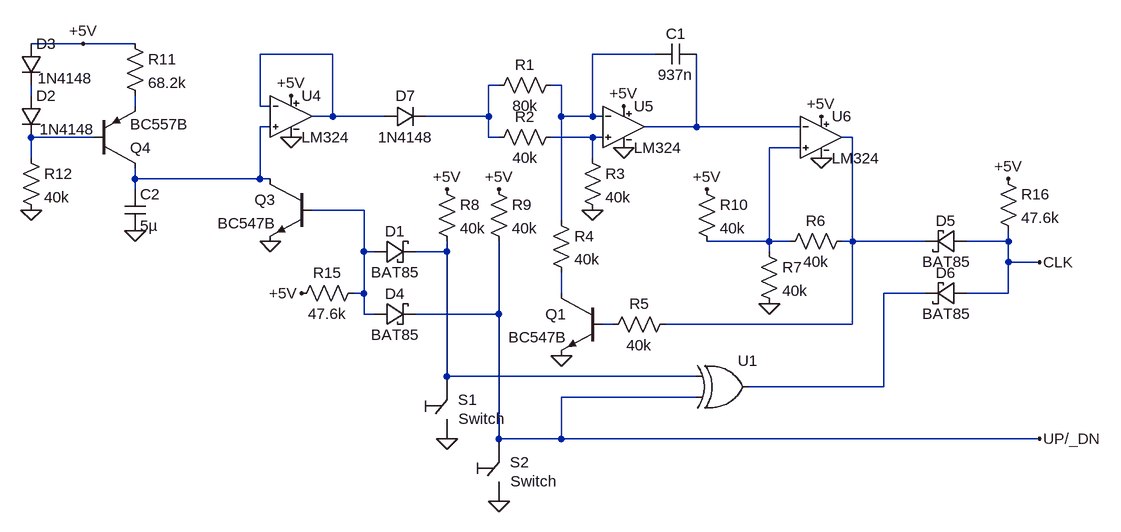
[diagram p0: schematic vol.asc]
vol.asc, the LTspice schematic file:
Version 4
SHEET 1 1748 756
WIRE -832 16 -912 16
WIRE -752 16 -832 16
WIRE -448 32 -560 32
WIRE 48 32 -48 32
WIRE -192 80 -208 80
WIRE -96 80 -112 80
WIRE -912 96 -912 80
WIRE -752 112 -752 96
WIRE -560 112 -560 32
WIRE -544 112 -560 112
WIRE -448 128 -448 32
WIRE -448 128 -480 128
WIRE -368 128 -448 128
WIRE -208 128 -208 80
WIRE -208 128 -304 128
WIRE -96 128 -96 80
WIRE -48 128 -48 32
WIRE -48 128 -96 128
WIRE -32 128 -48 128
WIRE -544 144 -560 144
WIRE 112 144 112 32
WIRE 112 144 32 144
WIRE 272 144 112 144
WIRE -816 160 -912 160
WIRE -208 160 -208 128
WIRE -192 160 -208 160
WIRE -48 160 -112 160
WIRE -32 160 -48 160
WIRE 352 160 336 160
WIRE 272 176 224 176
WIRE -912 192 -912 160
WIRE -48 192 -48 160
WIRE -752 224 -752 208
WIRE -560 224 -560 144
WIRE -560 224 -752 224
WIRE -544 224 -560 224
WIRE -752 240 -752 224
WIRE -400 272 -480 272
WIRE -96 288 -96 128
WIRE 224 320 224 176
WIRE 224 320 128 320
WIRE 256 320 224 320
WIRE 352 320 352 160
WIRE 352 320 336 320
WIRE 464 320 352 320
WIRE 592 320 592 304
WIRE 592 320 528 320
WIRE -400 336 -400 272
WIRE -384 336 -400 336
WIRE -272 336 -272 320
WIRE -272 336 -320 336
WIRE 224 336 224 320
WIRE 592 352 592 320
WIRE 640 352 592 352
WIRE -400 400 -400 336
WIRE -400 400 -416 400
WIRE -96 400 -96 368
WIRE 464 400 400 400
WIRE 592 400 592 352
WIRE 592 400 528 400
WIRE -400 432 -400 400
WIRE -384 432 -400 432
WIRE -192 432 -192 320
WIRE -192 432 -320 432
WIRE -16 448 -32 448
WIRE 352 448 352 320
WIRE 352 448 64 448
WIRE -272 528 -272 336
WIRE 112 528 -272 528
WIRE 400 544 400 400
WIRE 400 544 192 544
WIRE 112 560 -96 560
WIRE -192 624 -192 432
WIRE -96 624 -96 560
WIRE -96 624 -192 624
WIRE 640 624 -96 624
FLAG 0 112 +5V
FLAG 304 128 +5V
FLAG -48 272 0
FLAG -96 496 0
FLAG 224 416 0
FLAG -752 304 0
FLAG -512 96 +5V
FLAG 0 176 0
FLAG 304 192 0
FLAG 128 240 +5V
FLAG -832 16 +5V
FLAG -912 272 0
FLAG -496 400 +5V
FLAG 592 224 +5V
FLAG -512 160 0
FLAG 640 352 CLK
FLAG -272 624 0
FLAG -192 720 0
FLAG -272 240 +5V
FLAG -192 240 +5V
FLAG -544 320 0
FLAG 640 624 UP/_DN
SYMBOL cap 112 16 R90
WINDOW 0 0 32 VBottom 0
WINDOW 3 32 32 VTop 0
SYMATTR InstName C1
SYMATTR Value 937n
SYMBOL res -208 96 R270
WINDOW 0 32 56 VTop 0
WINDOW 3 0 56 VBottom 0
SYMATTR InstName R1
SYMATTR Value 80k
SYMBOL res -208 176 R270
WINDOW 0 32 56 VTop 0
WINDOW 3 0 56 VBottom 0
SYMATTR InstName R2
SYMATTR Value 40k
SYMBOL res -64 176 R0
SYMATTR InstName R3
SYMATTR Value 40k
SYMBOL res -112 272 R0
SYMATTR InstName R4
SYMATTR Value 40k
SYMBOL npn -32 400 M0
SYMATTR InstName Q1
SYMATTR Value BC547B
SYMBOL res 80 432 R90
WINDOW 0 0 56 VBottom 0
WINDOW 3 32 56 VTop 0
SYMATTR InstName R5
SYMATTR Value 40k
SYMBOL res 352 304 R90
WINDOW 0 0 56 VBottom 0
WINDOW 3 32 56 VTop 0
SYMATTR InstName R6
SYMATTR Value 40k
SYMBOL res 208 320 R0
SYMATTR InstName R7
SYMATTR Value 40k
SYMBOL cap -768 240 R0
SYMATTR InstName C2
SYMATTR Value 5µ
SYMBOL npn -480 224 M0
SYMATTR InstName Q3
SYMATTR Value BC547B
SYMBOL res 112 224 R0
SYMATTR InstName R10
SYMATTR Value 40k
SYMBOL pnp -816 208 M180
SYMATTR InstName Q4
SYMATTR Value BC557B
SYMBOL diode -928 96 R0
WINDOW 3 29 52 Left 0
SYMATTR Value 1N4148
SYMATTR InstName D2
SYMBOL diode -928 16 R0
WINDOW 3 26 53 Left 0
SYMATTR Value 1N4148
SYMATTR InstName D3
SYMBOL res -768 0 R0
SYMATTR InstName R11
SYMATTR Value 68.2k
SYMBOL res -928 176 R0
SYMATTR InstName R12
SYMATTR Value 40k
SYMBOL res -400 384 R90
WINDOW 0 0 56 VBottom 0
WINDOW 3 32 56 VTop 0
SYMATTR InstName R15
SYMATTR Value 47.6k
SYMBOL res 576 208 R0
SYMATTR InstName R16
SYMATTR Value 47.6k
SYMBOL myLib\\LM324 -512 64 R0
SYMATTR InstName U4
SYMBOL myLib\\LM324 0 80 R0
SYMATTR InstName U5
SYMBOL myLib\\LM324 304 96 R0
SYMATTR InstName U6
SYMBOL myLib\\BAT85 -384 352 R270
WINDOW 0 32 32 VTop 0
WINDOW 3 0 32 VBottom 0
SYMATTR InstName D1
SYMBOL myLib\\BAT85 -384 448 R270
WINDOW 0 32 32 VTop 0
WINDOW 3 0 32 VBottom 0
SYMATTR InstName D4
SYMBOL myLib\\BAT85 528 304 R90
WINDOW 0 0 32 VBottom 0
WINDOW 3 32 32 VTop 0
SYMATTR InstName D5
SYMBOL myLib\\BAT85 528 384 R90
WINDOW 0 0 32 VBottom 0
WINDOW 3 32 32 VTop 0
SYMATTR InstName D6
SYMBOL diode -368 144 R270
WINDOW 0 32 32 VTop 0
WINDOW 3 0 32 VBottom 0
SYMATTR InstName D7
SYMATTR Value 1N4148
SYMBOL res -288 224 R0
SYMATTR InstName R8
SYMATTR Value 40k
SYMBOL res -208 224 R0
SYMATTR InstName R9
SYMATTR Value 40k
SYMBOL myLib\\switch -336 656 R0
SYMATTR InstName S1
SYMBOL myLib\\switch -256 752 R0
SYMATTR InstName S2
SYMBOL myLib\\xor 160 480 R0
SYMATTR InstName U1

The netlist it stands for:
* vol.asc
C1 N007 N002 937n
R1 N003 N002 80k
R2 N003 N009 40k
R3 N009 0 40k
R4 N002 N014 40k
Q1 N014 N016 0 0 BC547B
R5 N010 N016 40k
R6 N010 N011 40k
R7 N011 0 40k
C2 N006 0 5µ
Q3 N006 N012 0 0 BC547B
R10 +5V N011 40k
Q4 N006 N008 N005 0 BC557B
D2 N004 N008 1N4148
D3 +5V N004 1N4148
R11 +5V N005 68.2k
R12 N008 0 40k
R15 N012 +5V 47.6k
R16 +5V CLK 47.6k
XU4 N006 N001 +5V 0 N001 LM324  ; pins In+ In- V+ V- OUT
XU5 N009 N002 +5V 0 N007 LM324  ; pins In+ In- V+ V- OUT
XU6 N011 N007 +5V 0 N010 LM324  ; pins In+ In- V+ V- OUT
XD1 N012 N013 BAT85  ; pins + -
XD4 N012 UP/_DN BAT85  ; pins + -
XD5 CLK N010 BAT85  ; pins + -
XD6 CLK N015 BAT85  ; pins + -
D7 N001 N003 1N4148
R8 +5V N013 40k
R9 +5V UP/_DN 40k
S1 0 N013 myLib\LM324.lib Switch Switch
S2 0 UP/_DN myLib\LM324.lib Switch Switch
U1 N013 UP/_DN N015 XOR
.model D D
.lib standard.dio
.model NPN NPN
.model PNP PNP
.lib standard.bjt
.lib myLib\LM324.lib
.lib myLib\BAT85.lib
.backanno
.end